# Altium schematic sheet Zynq SERDES.SchDoc
size Tabloid; ApprovedBy: NA
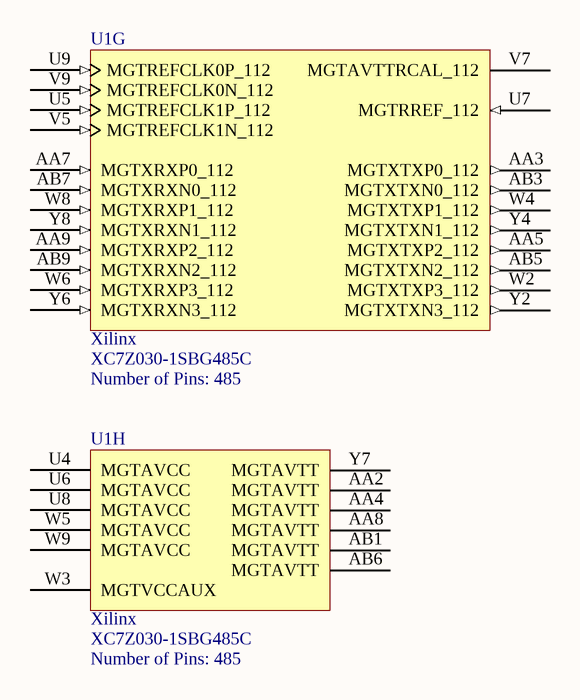
[diagram p0: Zynq SERDES.SchDoc]

## Parts
U1  Manufacturer: Xilinx  Manufacturer Part Number: XC7Z030-1SBG485C  Number of Pins: 485  [SBG484]  (hidden comment: U_XNLX-XC7Z030-1SBG485C)  (parts G,H of 10)

## Nets

Not connected (* = marked no-connect by the designer): U1 AA2(MGTAVTT) AA3(MGTXTXP0_112) AA4(MGTAVTT) AA5(MGTXTXP2_112) AA7(MGTXRXP0_112) AA8(MGTAVTT) AA9(MGTXRXP2_112) AB1(MGTAVTT) AB3(MGTXTXN0_112) AB5(MGTXTXN2_112) AB6(MGTAVTT) AB7(MGTXRXN0_112) AB9(MGTXRXN2_112) U4(MGTAVCC) U5(MGTREFCLK1P_112) U6(MGTAVCC) U7(MGTRREF_112) U8(MGTAVCC) U9(MGTREFCLK0P_112) V5(MGTREFCLK1N_112) V7(MGTAVTTRCAL_112) V9(MGTREFCLK0N_112) W2(MGTXTXP3_112) W3(MGTVCCAUX) W4(MGTXTXP1_112) W5(MGTAVCC) W6(MGTXRXP3_112) W8(MGTXRXP1_112) W9(MGTAVCC) Y2(MGTXTXN3_112) Y4(MGTXTXN1_112) Y6(MGTXRXN3_112) Y7(MGTAVTT) Y8(MGTXRXN1_112)

## Notes on the sheet
- Project:
- http://www.cospandesign.com
- Cospan Design
- Document:
- Engineer:
- Title:
- Client:
- Approved By:
- Revision:
- Date:
- Number:
- of

## Library data of the parts
U1 = U_XNLX-XC7Z030-1SBG485C: MPU Zynq-7000 RISC 32-Bit 667MHz 1.5V/2V/2.5V 485-Pin FBGA; Speed Grade: -1; RAM Size: 256KB; Number of I/Os: 130; Interface: I2C,SPI,USB,CAN,Ethernet,MMC,SDIO,SD,UART,USART,EBI/EMI; Data Bus Width: 32b; Peripherals: DMA; Supplier 1: Digikey; Stock 1: 102; Pricing 1: 1=230.1 (USD); Case/Package: FBGA; Contact Plating: Copper,Tin,Silver; Min Operating Temperature: 0°C; Max Operating Temperature: 85°C; Packaging: Tray; Frequency: 667MHz; Max Frequency: 667MHz; ComponentLink1URL: https://datasheet.ciiva.com/48476/ds190-zynq-7000-overview-48476904.pdf; ComponentLink1Description: https://datasheet.ciiva.com/48476/ds190-zynq-7000-overview-48476904.pdf; Supplier Part Number 1: 122-1924-ND